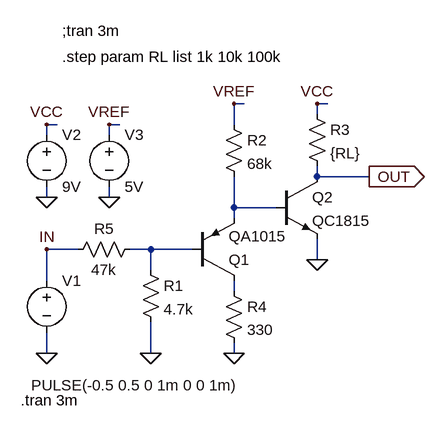
[diagram p0: schematic LadderFilter_CurrentSource_MiniMoog_2SC1814_2SA1015.asc]
LadderFilter_CurrentSource_MiniMoog_2SC1814_2SA1015.asc, the LTspice schematic file:
Version 4
SHEET 1 984 680
WIRE 352 -144 336 -144
WIRE 480 -144 464 -144
WIRE 464 -128 464 -144
WIRE 64 -112 48 -112
WIRE 160 -112 144 -112
WIRE 336 -112 336 -144
WIRE 48 -96 48 -112
WIRE 144 -96 144 -112
WIRE 464 -32 464 -48
WIRE 544 -32 464 -32
WIRE 48 0 48 -16
WIRE 144 0 144 -16
WIRE 336 16 336 -32
WIRE 400 16 336 16
WIRE 336 32 336 16
WIRE 96 80 48 80
WIRE 208 80 176 80
WIRE 272 80 208 80
WIRE 464 96 464 64
WIRE 208 112 208 80
WIRE 48 128 48 80
WIRE 336 144 336 128
WIRE 48 240 48 208
WIRE 208 240 208 192
WIRE 336 240 336 224
FLAG 48 240 0
FLAG 208 240 0
FLAG 464 96 0
FLAG 48 0 0
FLAG 48 -112 VCC
FLAG 336 -144 VREF
FLAG 464 -144 VCC
FLAG 48 80 IN
FLAG 336 240 0
FLAG 544 -32 OUT
IOPIN 544 -32 Out
FLAG 144 0 0
FLAG 144 -112 VREF
SYMBOL voltage 48 112 R0
WINDOW 3 -24 177 Left 2
WINDOW 123 0 0 Left 2
WINDOW 39 0 0 Left 2
SYMATTR Value PULSE(-0.5 0.5 0 1m 0 0 1m)
SYMATTR InstName V1
SYMBOL pnp 272 128 M180
SYMATTR InstName Q1
SYMATTR Value QA1015
SYMBOL res 192 96 R0
SYMATTR InstName R1
SYMATTR Value 4.7k
SYMBOL res 320 -128 R0
SYMATTR InstName R2
SYMATTR Value 68k
SYMBOL npn 400 -32 R0
SYMATTR InstName Q2
SYMATTR Value QC1815
SYMBOL res 448 -144 R0
SYMATTR InstName R3
SYMATTR Value {RL}
SYMBOL voltage 48 -112 R0
WINDOW 123 0 0 Left 2
WINDOW 39 0 0 Left 2
SYMATTR InstName V2
SYMATTR Value 9V
SYMBOL res 320 128 R0
SYMATTR InstName R4
SYMATTR Value 330
SYMBOL res 192 64 R90
WINDOW 0 0 56 VBottom 2
WINDOW 3 32 56 VTop 2
SYMATTR InstName R5
SYMATTR Value 47k
SYMBOL voltage 144 -112 R0
WINDOW 123 0 0 Left 2
WINDOW 39 0 0 Left 2
SYMATTR InstName V3
SYMATTR Value 5V
TEXT 72 -256 Left 2 !;tran 3m
TEXT 72 -216 Left 2 !.step param RL list 1k 10k 100k
TEXT 8 312 Left 2 !.tran 3m

The netlist it stands for:
* LadderFilter_CurrentSource_MiniMoog_2SC1814_2SA1015.asc
V1 IN 0 PULSE(-0.5 0.5 0 1m 0 0 1m)
Q1 N003 N002 N001 0 QA1015
R1 N002 0 4.7k
R2 VREF N001 68k
Q2 OUT N001 0 0 QC1815
R3 VCC OUT {RL}
V2 VCC 0 9V
R4 N003 0 330
R5 N002 IN 47k
V3 VREF 0 5V
.model NPN NPN
.model PNP PNP
.lib standard.bjt
;tran 3m
.step param RL list 1k 10k 100k
.tran 3m
.backanno
.end